# EAGLE design solar engine (EAGLE 5.10)
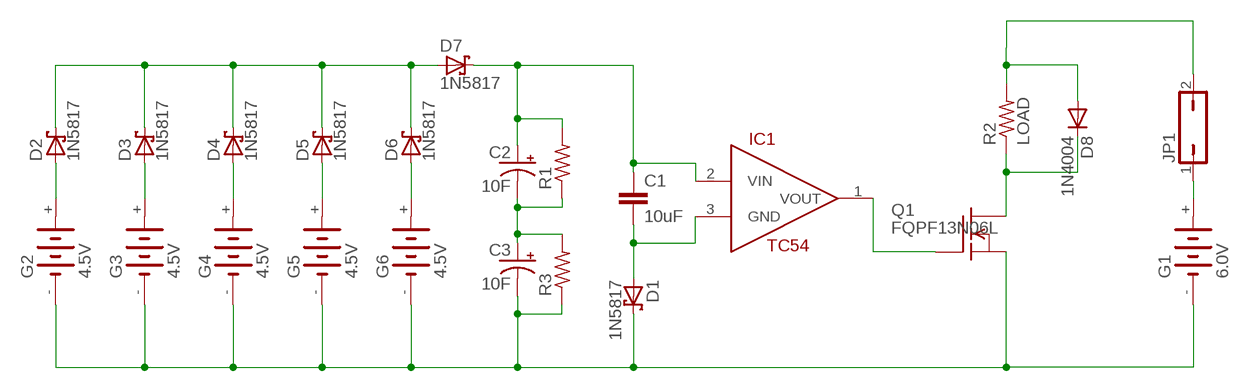
[diagram p0: schematic, sheet 1]

## Parts
C1  10uF  CAPPTH2  [CAP-PTH-SMALL2]
C2  10F  CAP_POLPTH3  [CPOL-RADIAL-1000UF-63V]
C3  10F  CAP_POLPTH3  [CPOL-RADIAL-1000UF-63V]
D1  1N5817  SCHOTTKY-DIODEDO41  [DO41-10]
D2  1N5817  SCHOTTKY-DIODEDO41  [DO41-10]
D3  1N5817  SCHOTTKY-DIODEDO41  [DO41-10]
D4  1N5817  SCHOTTKY-DIODEDO41  [DO41-10]
D5  1N5817  SCHOTTKY-DIODEDO41  [DO41-10]
D6  1N5817  SCHOTTKY-DIODEDO41  [DO41-10]
D7  1N5817  SCHOTTKY-DIODEDO41  [DO41-10]
D8  1N4004  [DO41-10]
G1  6.0V  3V11R  [3V11R]
G2  4.5V  3V11R  [3V11R]
G3  4.5V  3V11R  [3V11R]
G4  4.5V  3V11R  [3V11R]
G5  4.5V  3V11R  [3V11R]
G6  4.5V  3V11R  [3V11R]
IC1  TC54  [TO92-INLINE]
JP1  JP1Q  [JP1]
Q1  FQPF13N06L  FQN1N50CI  [TO92-INLINE]
R1  R-US_0617/5V  [0617V]
R2  LOAD  R-US_0617/5V  [0617V]
R3  R-US_0617/5V  [0617V]

## Nets
N$1: IC1.1(VOUT) Q1.2(G)
N$2: D8.C Q1.1(D) R2.1
N$3: C1.1 C2.1(+) D7.C IC1.2(VIN) R1.2
N$4: G1.+ JP1.1
N$5: D2.A G2.+
N$6: D8.A JP1.2 R2.2
N$7: D3.A G3.+
N$8: C1.2 D1.A IC1.3(GND)
N$14: D4.A G4.+
N$15: D5.A G5.+
N$16: D6.A G6.+
N$17: D2.C D3.C D4.C D5.C D6.C D7.A
N$18: C3.2(-) D1.C G1.- G2.- G3.- G4.- G5.- G6.- Q1.3(S) R3.1
N$19: C2.2(-) C3.1(+) R1.1 R3.2

## Library data of the parts
C1 = ideabot:CAP: Capacitor Standard 0603 ceramic capacitor, and 0.1" leaded capacitor.
C2 C3 = SparkFun:CAP_POL: Capacitor Polarized These are standard SMD and PTH capacitors. Normally 10uF, 47uF, and 100uF in electrolytic and tantalum varieties. Always verify the external diameter of the through hole cap, it varies with capacity, voltage, and manufacturer. The EIA devices should be standard.
D1-D7 = adafruit:SCHOTTKY-DIODE: Schottky Diode
D8 = adafruit:1N4004: DIODE General purpose 1N400x type rectifier (With bigger pads) http://www.ladyada.net/library/pcb/eaglelibrary.html
G1-G6 = battery:3V11R: NC ACCU Varta
IC1 = ideabot:TC54
JP1 = jumper:JP1Q: JUMPER
Q1 = adafruit:FQN1N50C: N-Channel Enhancement MOSFET 500V, 0.4A, 6.0 Ohm
R1-R3 = adafruit:R-US_: RESISTOR, American symbol

## Board
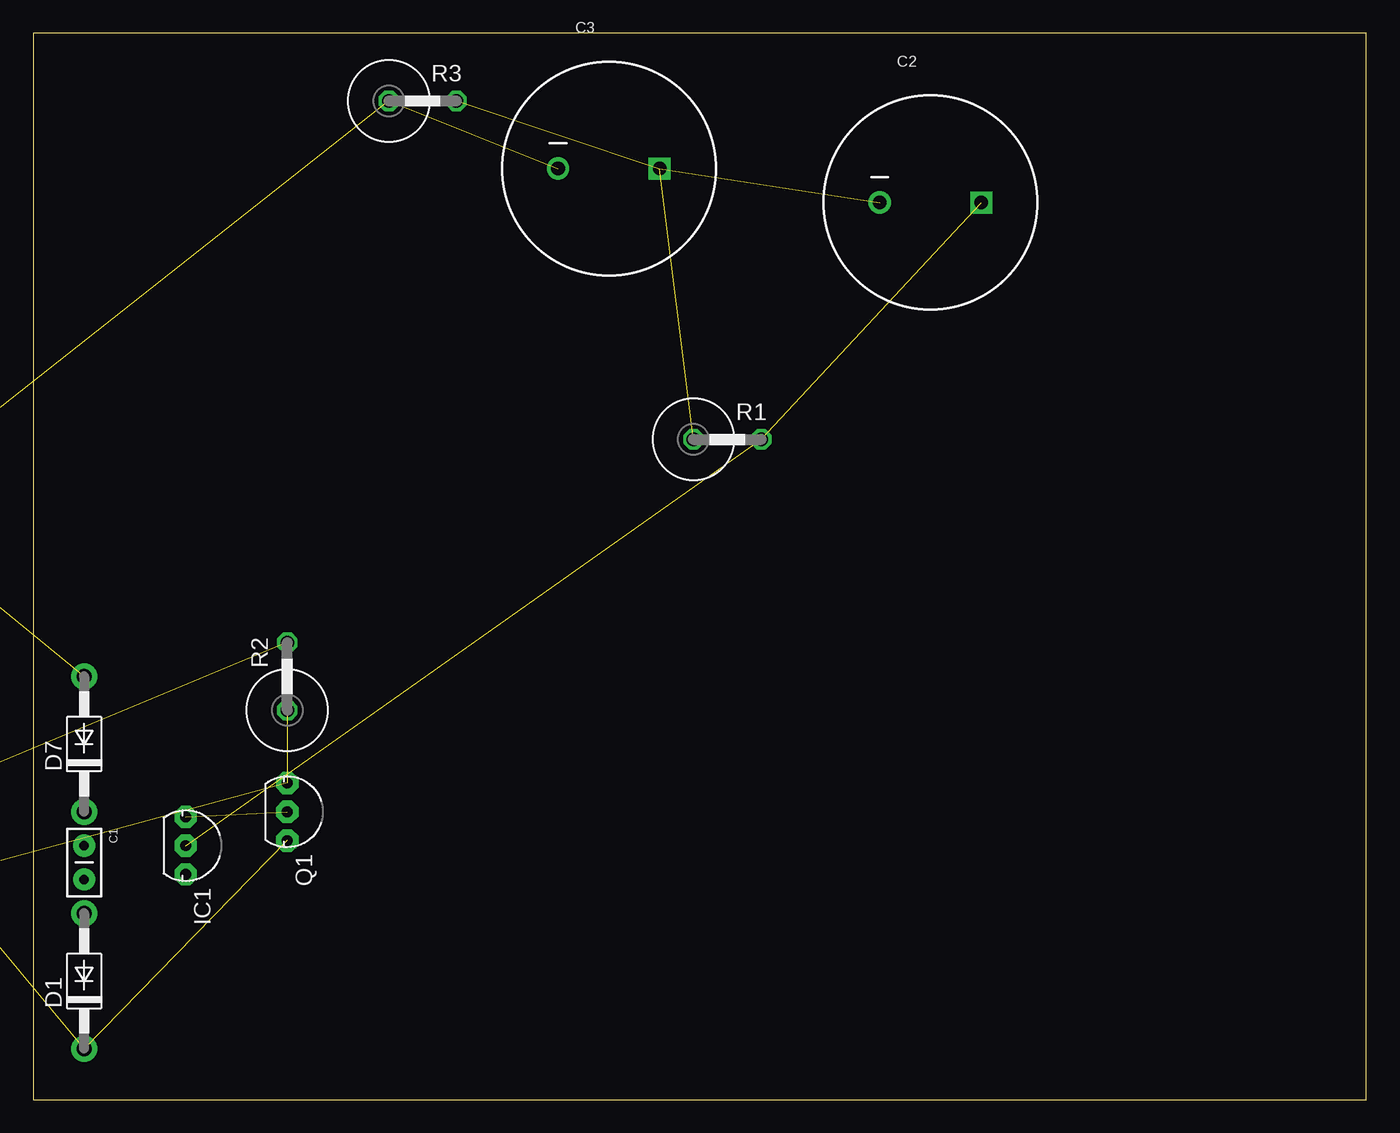
[diagram p1: board, top side]
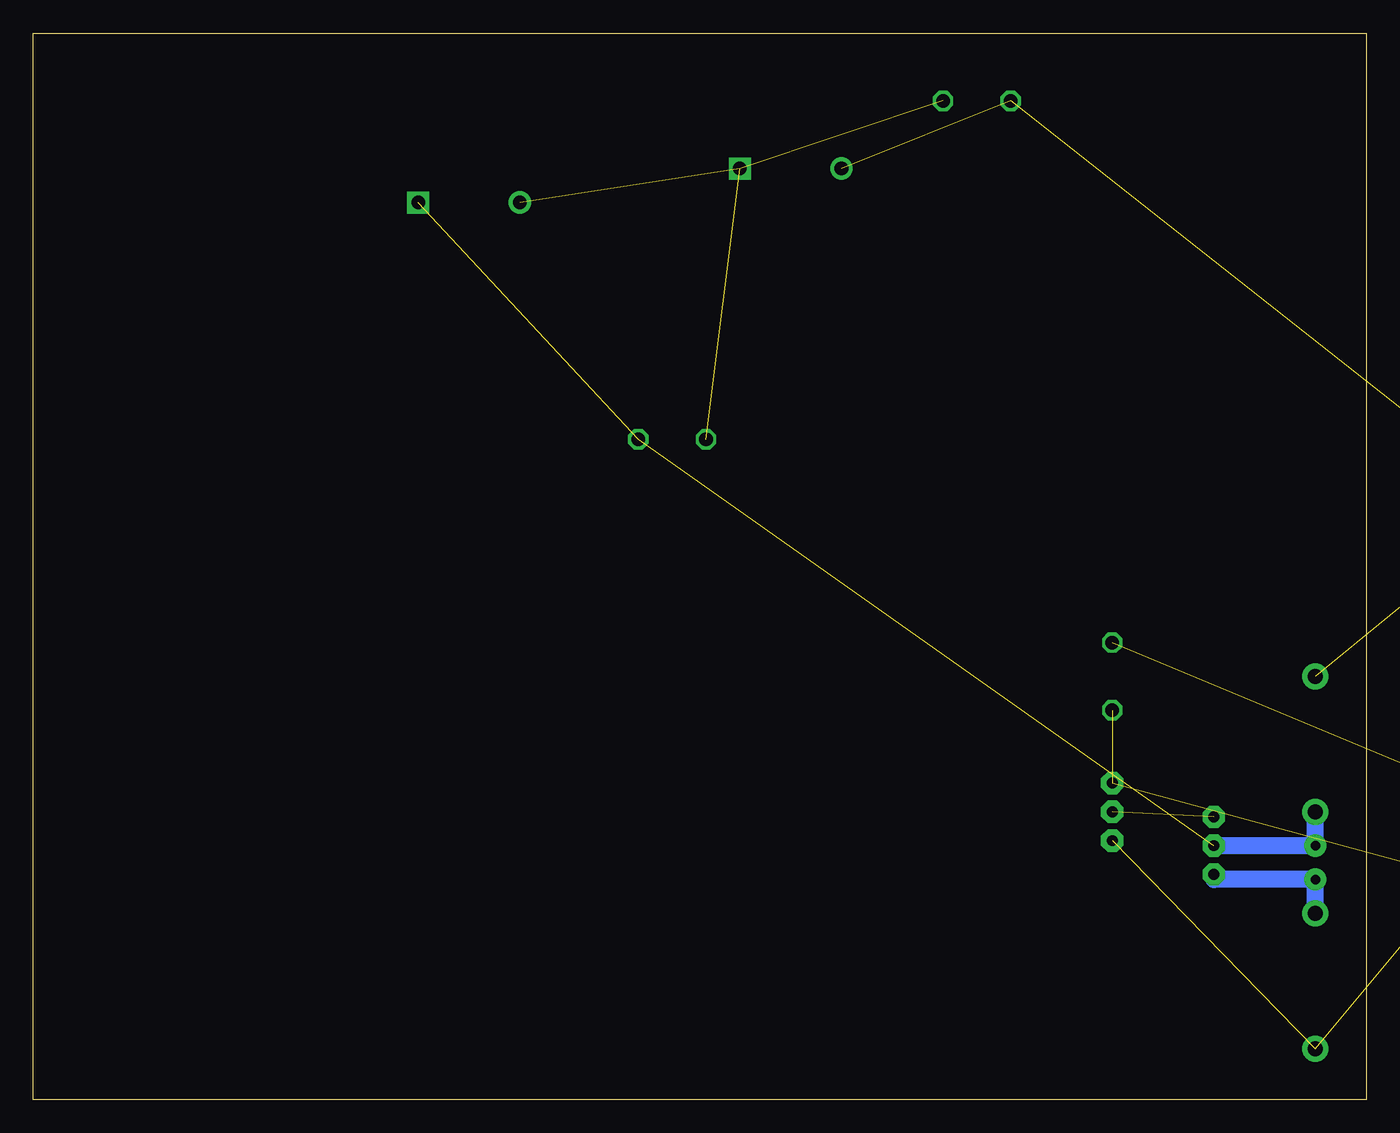
[diagram p2: board, bottom side, seen from below]

Size 100 x 80 mm. Coordinates in mm from the lower left corner, seen from the top.
Outline: 0,0 100,0 100,80 0,80 0,0
Copper layers (1*16): Top 0.035mm / dielectric 1.5mm / Bottom 0.035mm
Design rules "default": minimum track width 10mil, minimum drill 24mil, track to track 8mil, track to pad 8mil, pad to pad 8mil, via to via 8mil, smd to smd 8mil, copper to edge 40mil, drill to drill 8mil, minimum pad ring 10mil, minimum via ring 8mil, stop-mask expansion 4mil, vias tented up to drill 0mil, thermal gap 10mil

### Footprints (pad centres in the part's own frame; a part is rotated, then mirrored left to right if it is on the bottom)
CAP-PTH-SMALL2 = drill 0.7 pad 1.651 round: 1 0,0; 2 2.54,0
CPOL-RADIAL-1000UF-63V = drill 1.016 pad 1.651 square: 1 3.81,0 | drill 1.016 pad 1.676 round: 2 -3.81,0
DO41-10 = drill 1.118 pad 1.93 round: A 5.08,0; C -5.08,0
3V11R = drill 1.118 pad 2.54 octagon: + -5.08,0; - 5.08,0
TO92-INLINE = drill 0.813 pad 1.676 octagon: 1 -2.159,0; 2 0,0; 3 2.159,0
JP1 = drill 0.914 long: 1 0,-1.27; 2 0,1.27
0617V = drill 1.016 octagon: 1 -2.54,0; 2 2.54,0

### Placement (x,y rotation side)
C1  3.81,19.05 270 top
C2  67.31,67.31 0 top
C3  43.18,69.85 0 top
D1  3.81,8.89 90 top
D2  -45.72,39.37 0 top  (outside the outline)
D3  -19.05,54.61 0 top  (outside the outline)
D4  -31.75,54.61 0 top  (outside the outline)
D5  -44.45,54.61 0 top  (outside the outline)
D6  -57.15,54.61 0 top  (outside the outline)
D7  3.81,26.67 90 top
D8  -77.47,-3.81 0 top  (outside the outline)
G1  -69.85,6.35 0 top  (outside the outline)
G2  -53.34,6.35 0 top  (outside the outline)
G3  -20.32,26.67 0 top  (outside the outline)
G4  -34.29,26.67 0 top  (outside the outline)
G5  -48.26,26.67 0 top  (outside the outline)
G6  -20.32,41.91 0 top  (outside the outline)
IC1  11.43,19.05 270 top
JP1  -80.01,3.81 0 top  (outside the outline)
Q1  19.05,21.59 270 top
R1  52.07,49.53 0 top
R2  19.05,31.75 90 top
R3  29.21,74.93 0 top

### Tracks (layer width: path | path; a pad name or v marks a point on that pad's centre or on a via)
N$1  (1 unrouted)
N$2  (2 unrouted)
N$3  (2 unrouted)
  Bottom 1.27: IC1.2 C1.1 D7.C
N$4  (1 unrouted)
N$5  (1 unrouted)
N$6  (2 unrouted)
N$7  (1 unrouted)
N$8
  Bottom 1.27: IC1.3 11.43,16.51 C1.2 D1.A
N$14  (1 unrouted)
N$15  (1 unrouted)
N$16  (1 unrouted)
N$17  (5 unrouted)
N$18  (9 unrouted)
N$19  (3 unrouted)